# Altium schematic sheet PSU.SchDoc
size Tabloid; SheetNumber: 9; SheetTotal: 9
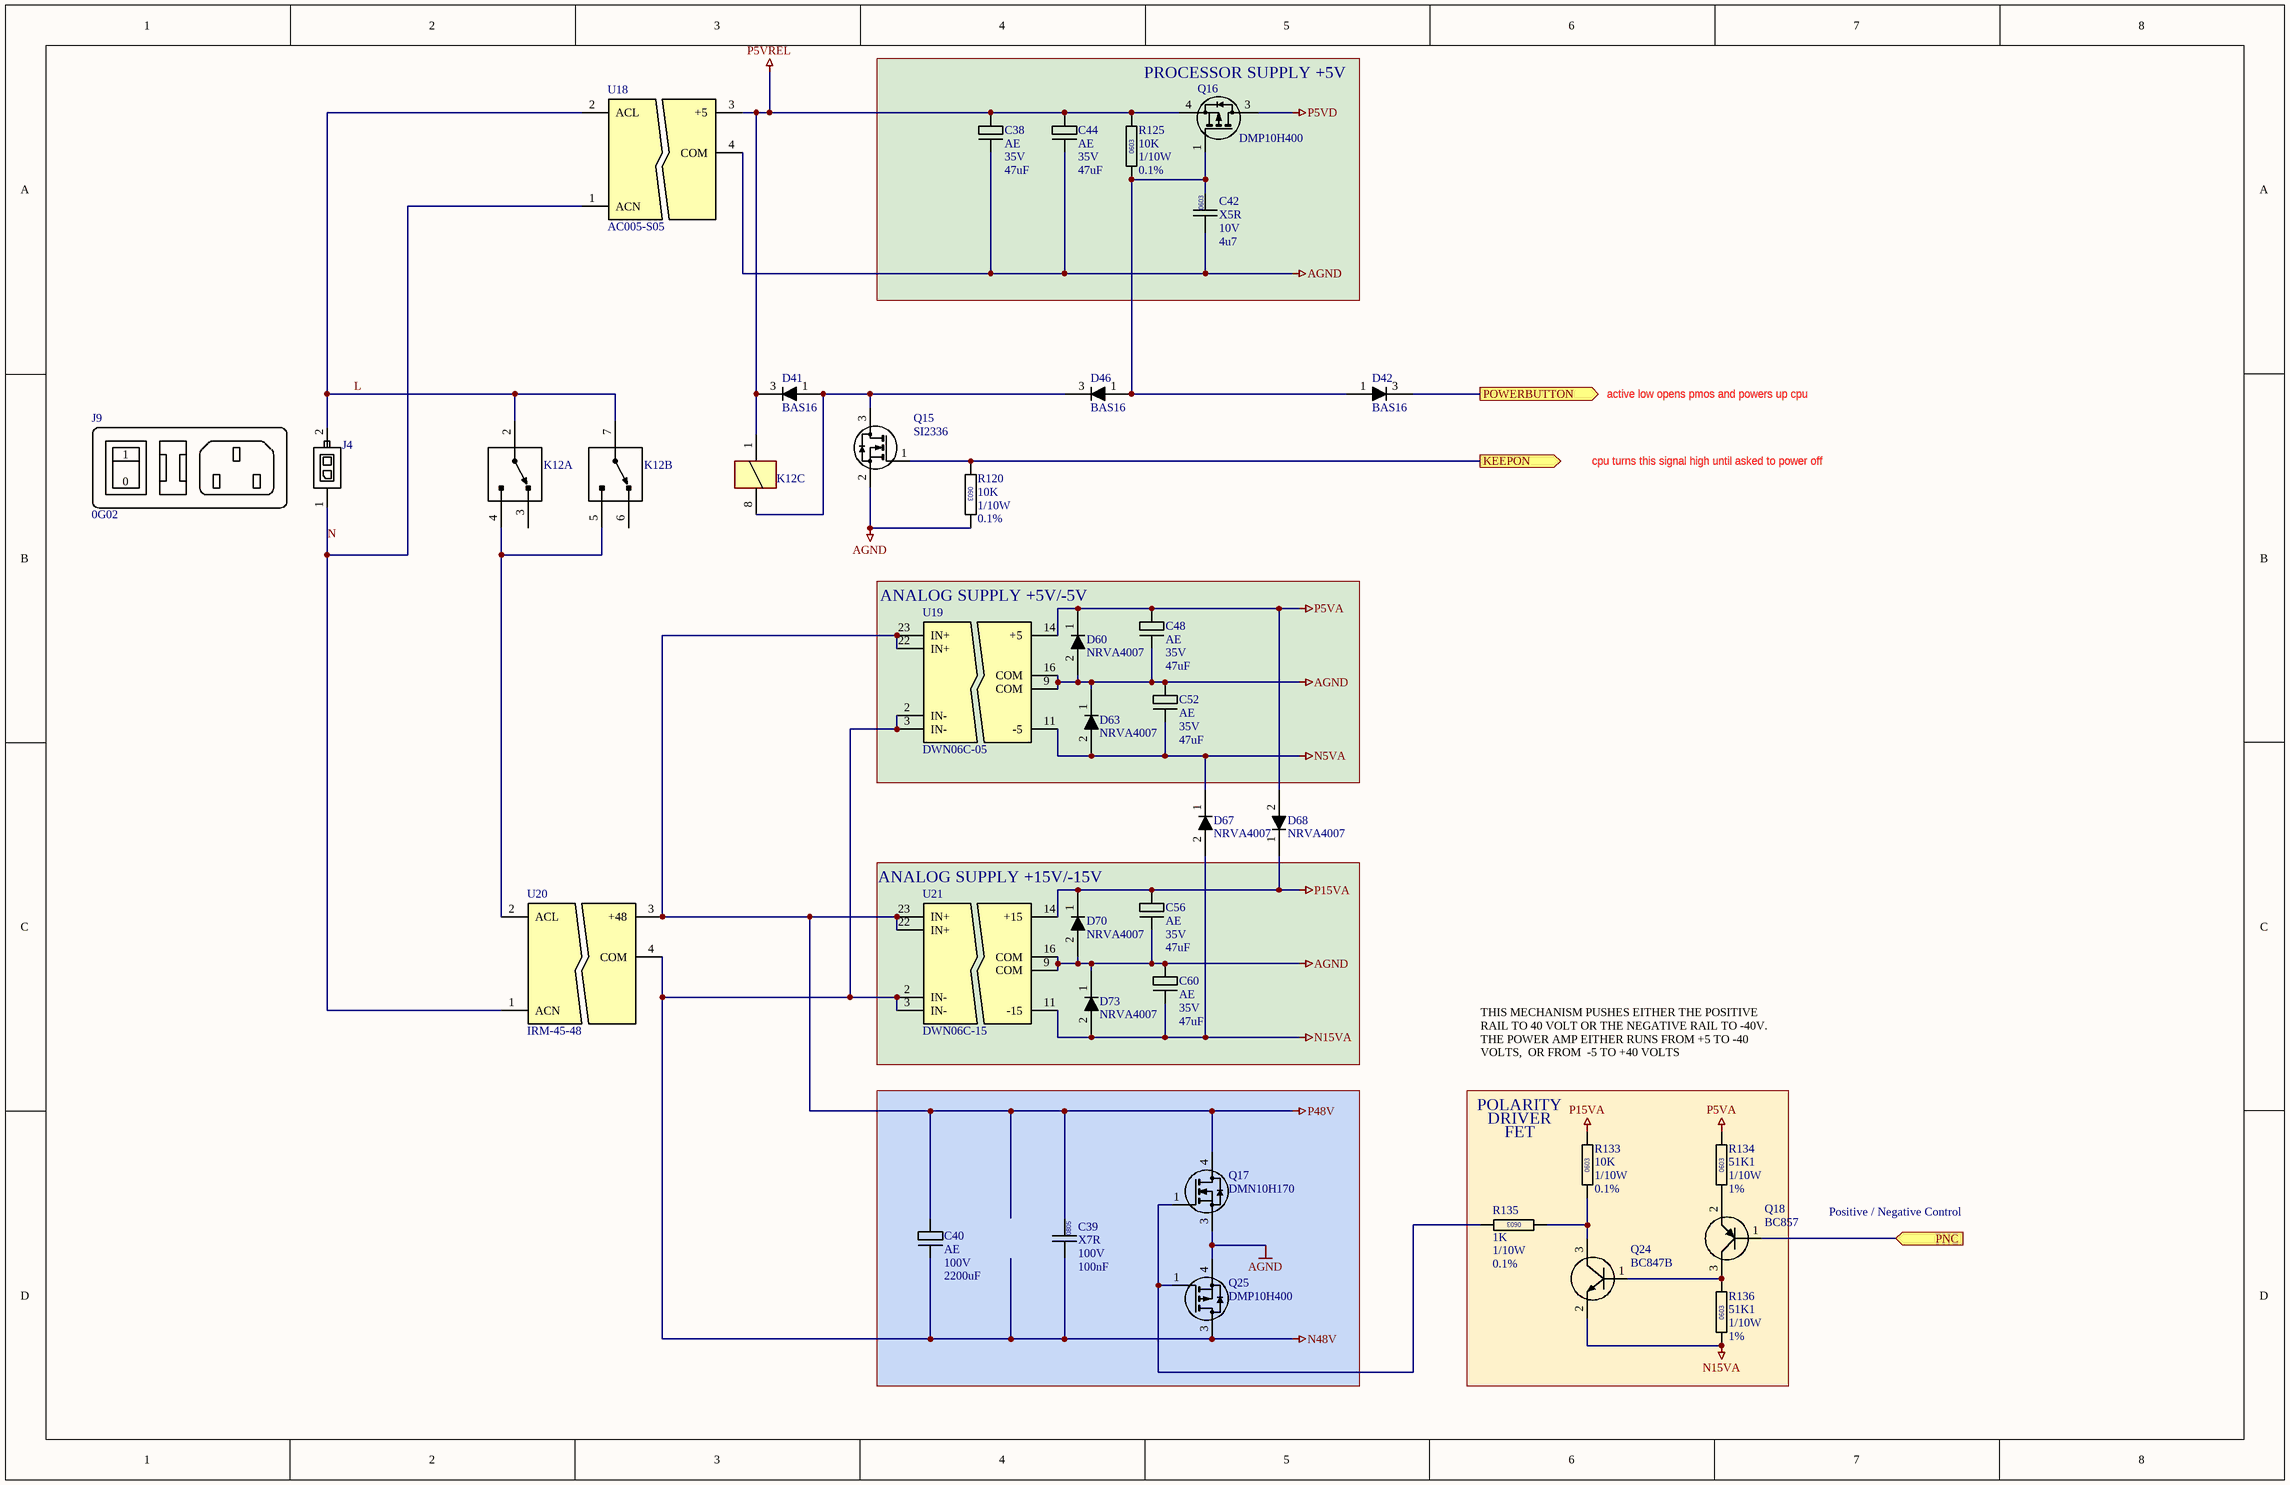
[diagram p0: PSU.SchDoc]

## Parts
C38  Dielectric: AE  Voltage: 35V  Capacitance: 47uF  [CAPAE-KEMET-ESW476M035AE3AA]  (hidden comment: CAP0603)
C39  Dielectric: X7R  Voltage: 100V  Capacitance: 100nF  [CAPC0805]  (hidden comment: CAP0805)
C40  Dielectric: AE  Voltage: 100V  Capacitance: 2200uF  [CAPAE-NICHICON-LGY2A222MELC30]  (hidden comment: CAP0603)
C42  Dielectric: X5R  Voltage: 10V  Capacitance: 4u7  [CAPC0603]  (hidden comment: CAP0603)
C44  Dielectric: AE  Voltage: 35V  Capacitance: 47uF  [CAPAE-KEMET-ESW476M035AE3AA]  (hidden comment: CAP0603)
C48  Dielectric: AE  Voltage: 35V  Capacitance: 47uF  [CAPAE-KEMET-ESW476M035AE3AA]  (hidden comment: CAP0603)
C52  Dielectric: AE  Voltage: 35V  Capacitance: 47uF  [CAPAE-KEMET-ESW476M035AE3AA]  (hidden comment: CAP0603)
C56  Dielectric: AE  Voltage: 35V  Capacitance: 47uF  [CAPAE-KEMET-ESW476M035AE3AA]  (hidden comment: CAP0603)
C60  Dielectric: AE  Voltage: 35V  Capacitance: 47uF  [CAPAE-KEMET-ESW476M035AE3AA]  (hidden comment: CAP0603)
D41  BAS16  [SOT23]
D42  BAS16  [SOT23]
D46  BAS16  [SOT23]
D60  NRVA4007  [DO214AC]
D63  NRVA4007  [DO214AC]
D67  NRVA4007  [DO214AC]
D68  NRVA4007  [DO214AC]
D70  NRVA4007  [DO214AC]
D73  NRVA4007  [DO214AC]
J4  CONNECTOR-MOLEX-43045-0202  [CONN-MOLEX-430450214]  (value not drawn)
J9  0G02  (mechanical)
K12  RELAY-CIT-J104B2C5VDC.20S  [RELAY-CIT-J104B2C5VDC.20S]  (value not drawn)  (parts A,B,C of 3)
Q15  SI2336  [SOT23]
Q16  DMP10H400  [DPAK]
Q17  DMN10H170  [DPAK]
Q18  BC857  [SOT23]
Q24  BC847B  [SOT23]
Q25  DMP10H400  [DPAK]
R120  value 10K  Power: 1/10W  Tolerance: 0.1%  [RESC0603]  (hidden comment: RESC0603)
R125  value 10K  Power: 1/10W  Tolerance: 0.1%  [RESC0603]  (hidden comment: RESC0603)
R133  value 10K  Power: 1/10W  Tolerance: 0.1%  [RESC0603]  (hidden comment: RESC0603)
R134  value 51K1  Power: 1/10W  Tolerance: 1%  [RESC0603]  (hidden comment: RESC0603)
R135  value 1K  Power: 1/10W  Tolerance: 0.1%  [RESC0603]  (hidden comment: RESC0603)
R136  value 51K1  Power: 1/10W  Tolerance: 1%  [RESC0603]  (hidden comment: RESC0603)
U18  AC005-S05  [MODULE-ADAMTECH-AC005-S05]
U19  DWN06C-05  [MODULE-MEANWELL-DCWN06C]
U20  IRM-45-48  [MODULE-MEANWELL-IRM-45-48]
U21  DWN06C-15  [MODULE-MEANWELL-DCWN06C]

## Blocks framed on the sheet
PROCESSOR SUPPLY +5V: C38 C42 C44 Q16 R125
ANALOG SUPPLY +5V/-5V: C48 C52 D60 D63 U19
ANALOG SUPPLY +15V/-15V: C56 C60 D70 D73 U21

## Ports
KEEPON (out), PNC (in), POWERBUTTON (out)

## Nets
AGND: C38.2 C42.2 C44.2 C48.2 C52.1 C56.2 C60.1 D60.2(A) D63.1(K) D70.2(A) D73.1(K) Q15.2(S) Q17.3(S) Q25.4(S) R120.1 U18.4(COM) U19.9(COM) U19.16(COM) U21.9(COM) U21.16(COM)
N5VA: C52.2 D63.2(A) D67.1(K) U19.11(-5)
N15VA: C60.2 D67.2(A) D73.2(A) Q24.2(E) R136.2 U21.11(-15)
N48V: C39.2 C40.2 Q25.3(D) U19.2(IN-) U19.3(IN-) U20.4(COM) U21.2(IN-) U21.3(IN-)
P5VA: C48.1 D60.1(K) D68.2(A) R134.1 U19.14(+5)
P5VD: Q16.3(D)
P5VREL: C38.1 C44.1 D41.3(K) K12.1 Q16.4(S) R125.1 U18.3(+5)
P15VA: C56.1 D68.1(K) D70.1(K) R133.1 U21.14(+15)
P48V: C39.1 C40.1 Q17.4(D) U19.22(IN+) U19.23(IN+) U20.3(+48) U21.22(IN+) U21.23(IN+)
KEEPON: Q15.1(G1) R120.2 ; port KEEPON
L: J4.2 K12.2(NC) K12.7(NC) U18.2(ACL)
N: J4.1 U18.1(ACN) U20.1(ACN)
PNC: Q18.1(B) ; port PNC
POWERBUTTON: D42.3(K) ; port POWERBUTTON
NetC42_1: C42.1 D42.1(A) D46.1(A) Q16.1(G1) R125.2
NetD41_1: D41.1(A) D46.3(K) K12.8 Q15.3(D)
NetK12_4: K12.4(NO) K12.5(NO) U20.2(ACL)
NetQ17_1: Q17.1(G1) Q25.1(G1) R135.2
NetQ18_2: Q18.2(E) R134.2
NetQ18_3: Q18.3(C) Q24.1(B) R136.1
NetQ24_3: Q24.3(C) R133.2 R135.1

Not connected (* = marked no-connect by the designer): K12 3(COM) 6(COM)

## Notes on the sheet
- active low opens pmos and powers up cpu
- cpu turns this signal high until asked to power off
- THIS MECHANISM PUSHES EITHER THE POSITIVE RAIL TO 40 VOLT OR THE NEGATIVE RAIL TO -40V.
  THE POWER AMP EITHER RUNS FROM +5 TO -40 VOLTS,  OR FROM  -5 TO +40 VOLTS
- (near R133) POLARITY
- (near R133) DRIVER
- FET
- Positive / Negative Control
- (in symbol CAPC-0805-100nF-100V) 0805
- (in symbol CONN-DELTA-0G02) 1; 0
- (in symbol RESC-0603-1K-0.1%-1/10W) 0603
- (in symbol RESC-0603-10K-0.1%-1/10W) 0603
- (in symbol RESC-0603-51K1-1%-1/10W) 0603

## Library data of the parts
C38 C44 C48 C52 C56 C60 = CAPP-AE-47uF-35V-TH025P063D125H: CAPACITOR,ALU,47uF,35V,TH,P0.25mm,D6.3mm,H12.5mm; Manufacturer 1: KEMET; Manufacturer Part Number 1: ESW476M035AE3AA; Location: *
C39 = CAPC-0805-100nF-100V: CAPACITOR,CERAMIC,100nF,100V,X7R,0805; Package / Case: 0805 (2012 metric); Location: *
C40 = CAPP-AE-2200uF-100V-TH100P350D320H: CAPACITOR,ALU,2200uF,100V,TH,P10mm,D35mm,H32mm,SNAP; Manufacturer 1: NICHICON; Manufacturer Part Number 1: LGY2A222MELC30; Location: *
C42 = CAPC-0603-4u7-10V-X5R: CAPACITOR,CERAMIC,4u7,10V,X5R,0603; Manufacturer 1: SAMSUNG; Manufacturer Part Number 1: CL10A475KP8NNNC; Package / Case: 0603; Location: *; Supplier 1: Arrow Electronics; Supplier Part Number 1: GRM188Z71A475KE15J; LCSC: C1705; MOUSER: 187-CL10A475KP8NNNC
D41 D42 D46 = DIODE-RECTIFIER-DIODES-BAS16-SOT23: DIODE,RECTIFIER,75V,0.3A,BAS16,SOT23; Manufacturer 1: ONSEMI; Manufacturer Part Number 1: BAS16LT1G; DIGIKEY: BAS16LT1GOSCT-ND
D60 D63 D67 D68 D70 D73 = DIODE-ONSEMI-NRVA4007T3G: DIODE,RECTIFIER,1000V,1A,ONSEMI,NRVA4007,SMA; DIGIKEY: NRVA4007T3GOSCT-ND; Manufacturer 1: ONSEMI; Manufacturer Part Number 1: NRVA4007T3G
J4 = CONN-MOLEX-430450214: CONN,1X2,MOLEX, MICROFIT,VERT
J9 = CONN-DELTA-0G02: CONN,POWER,IEC,SWITCH,FUSE ASSEMBLY,PANELMOUNT
K12 = RELAY-CIT-J104B2C5VDC.20S: RELAY,DPDT,5V COIL,250VAC,3A; Manufacturer 1: CIT; DIGIKEY: 2449-J104B2C5VDC.20S-ND; Manufacturer Part Number 1: J104B2C5VDC.20S
Q15 = XSTR-NMOS-VISHAY-SI2336DS-T1-BE3: XSTR,NMOS,30V,4.3A,SI2336DS-T1-BE3.SOT23; Manufacturer 1: VISHAY; Package: SOT23; Vds: 30V; Idmax: 4.3A; DIGIKEY: 742-SI2336DS-T1-BE3CT-ND; Manufacturer Part Number 1: SI2336DS-T1-BE3
Q16 Q25 = XSTR-PMOS-DIODES-DMP10H400SK3-13: XSTR,PMOS,100V,5.6A,DMP10H400SK3-13,DPAK; Manufacturer 1: DIODES; Idmax: 9A; Package: DPAK; Vds: 100V; Manufacturer Part Number 1: DMP10H400SK3-13
Q17 = XSTR-NMOS-DIODES-DMN10H170SK3-13: XSTR,NMOS,100V,12A,DMN10H170SK3-13,DPAK; Manufacturer 1: DIODES; Idmax: 5.6; Package: DPAK; Vds: 100V; Manufacturer Part Number 1: DMN10H170SK3-13
Q18 = XSTR-PNP-BC857: XSTR,PNP,SOT23,BC857,SOT23
Q24 = XSTR-NPN-BC847: XSTR,NPN,45V,0.1A,,BC847B,SOT23
R120 R125 R133 = RESC-0603-10K-0.1%-1/10W: RESISTOR,10K,0.1%,100mW,0603 (1608); Location: *
R134 R136 = RESC-0603-51K1-1%-1/10W: RESISTOR,51K1,1%,100mW,0603 (1608); Location: *
R135 = RESC-0603-1K-0.1%-1/10W: RESISTOR,1K,0.1%,100mW,0603 (1608); Location: *
U18 = MODULE-ADAMTECH-AC005-S05: MOD,AC/DC,ISO,90...264 AC,+5V OUT,1A
U19 = MODULE-MEANWELL-DWN06C-05: MOD,DC/DC,ISO,DC 36...72V IN,+/-5V OUT,1A
U20 = MODULE-MEANWELL-IRM-45-48: MOD,AC/DC,ISO,90...264 AC,+48V OUT,1A
U21 = MODULE-MEANWELL-DWN06C-15: MOD,DC/DC,ISO,DC 36...72V IN,+/-15V OUT,200mA